# Altium schematic sheet DIG_INTERFACES.SchDoc
size A3; DocumentNumber: 3; Revision: B; SheetNumber: 3; SheetTotal: 7; SheetTitle: Connectors and Power; Designer: DM; Reviewer: -
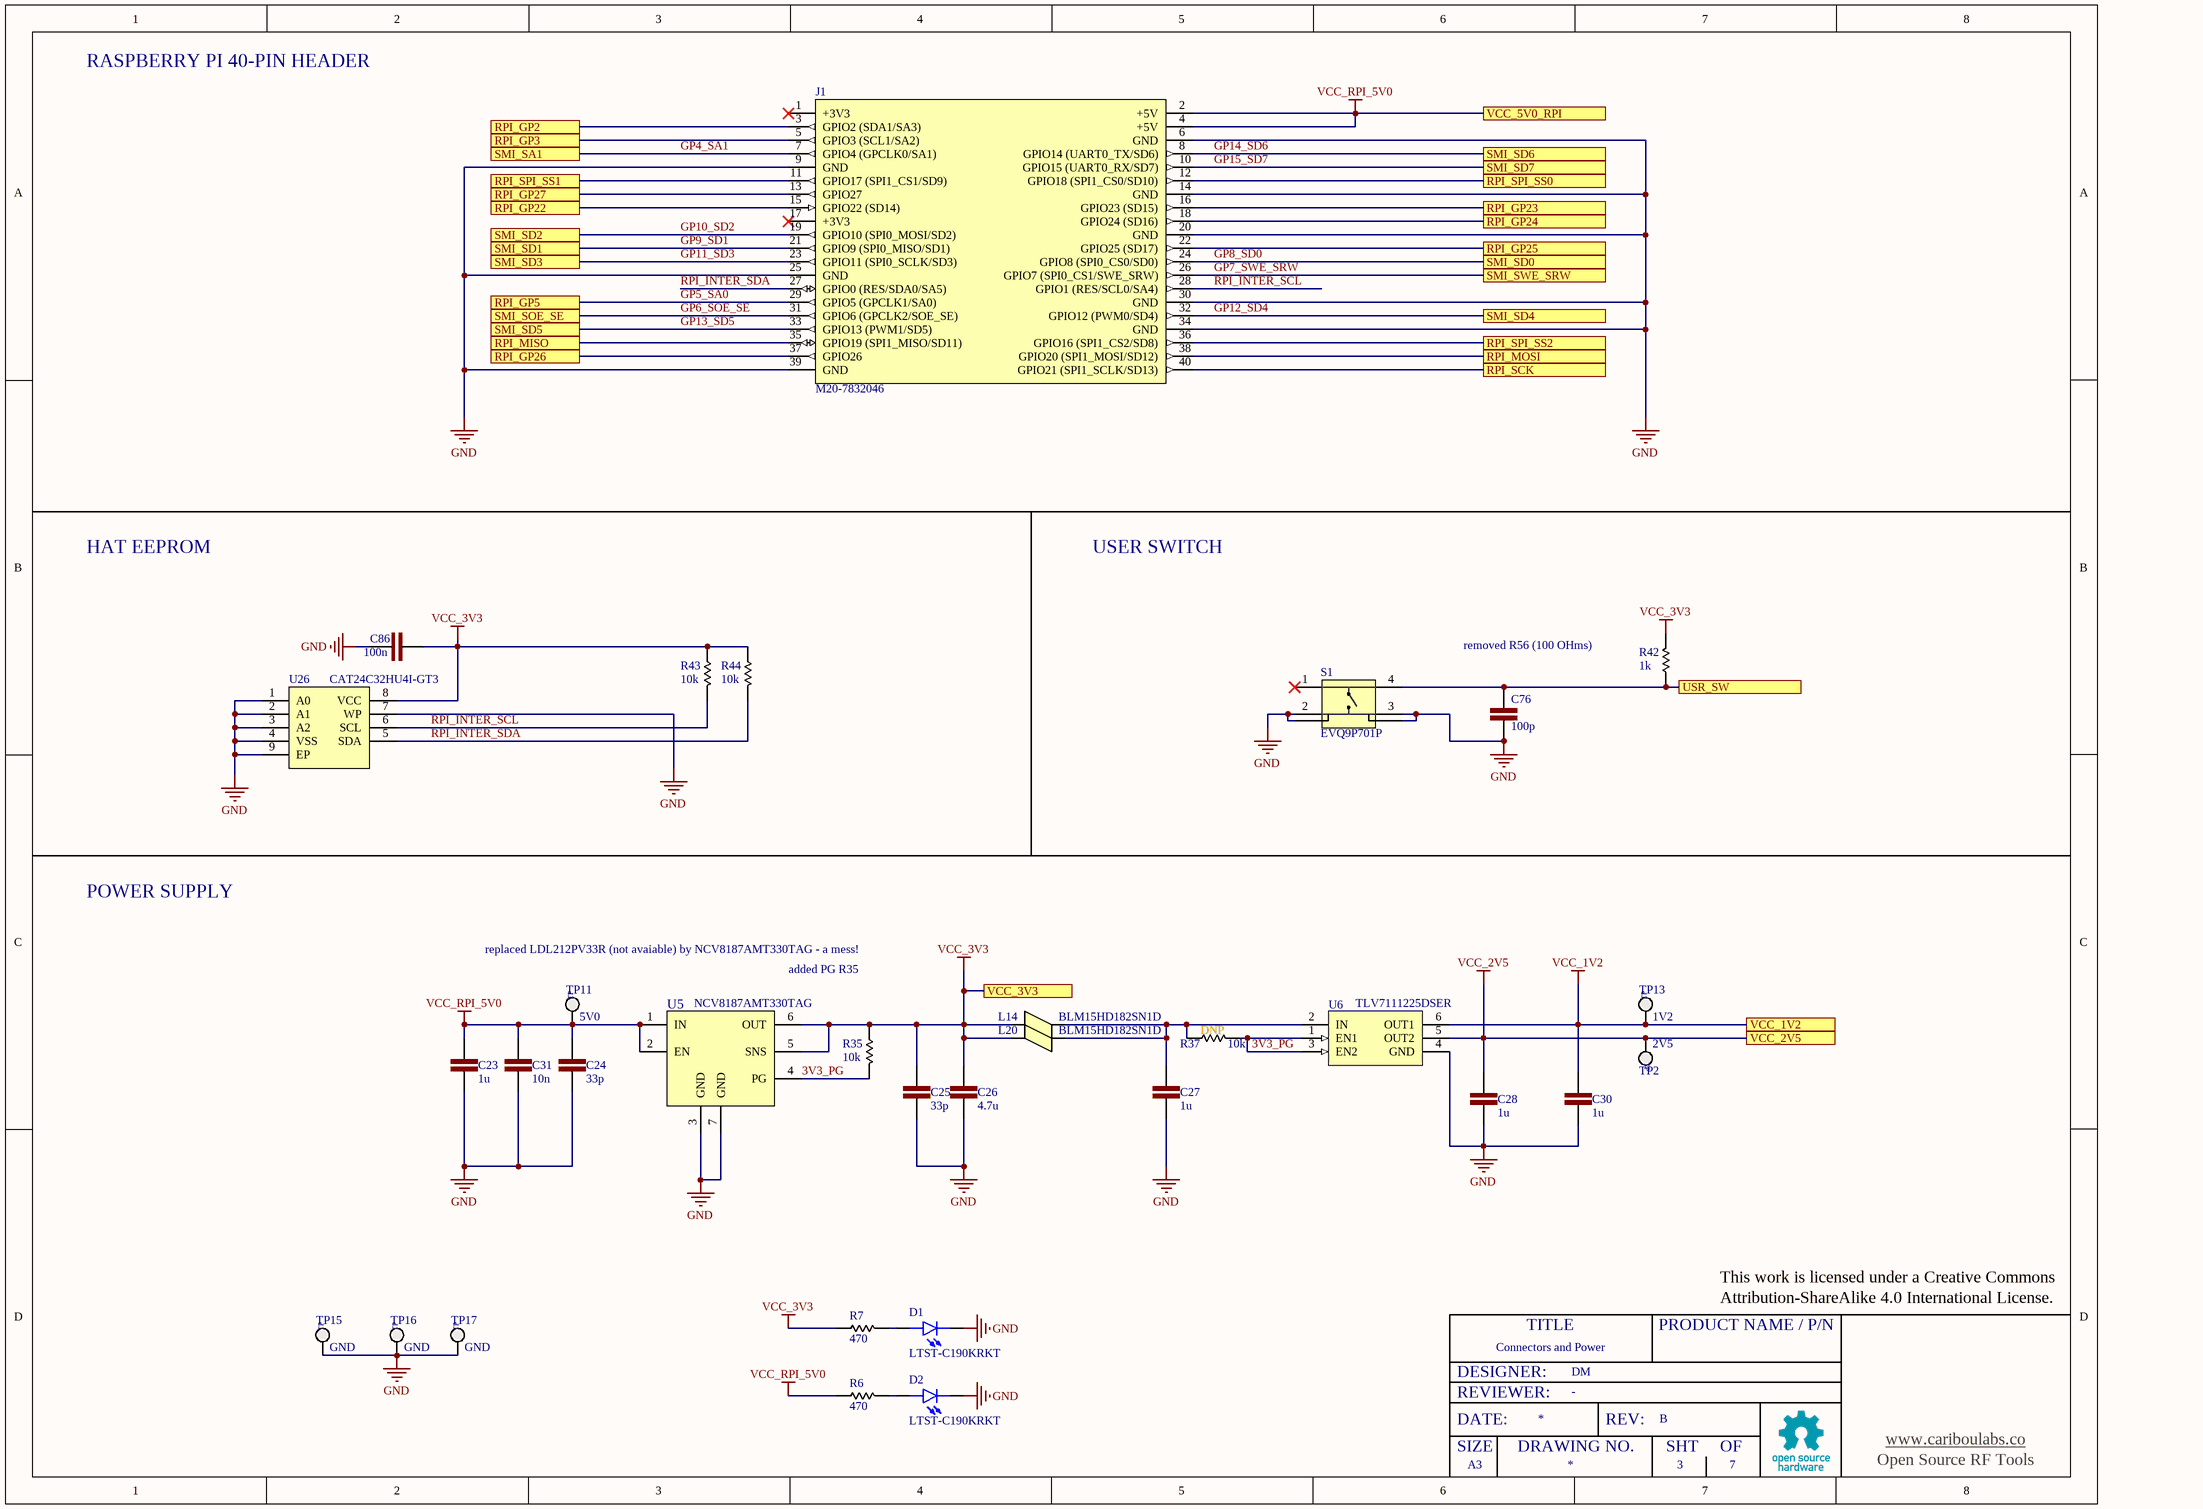
[diagram p0: DIG_INTERFACES.SchDoc]

## Parts
C23  1u  [MURATA 0402]
C24  33p  [MURATA 0402]
C25  33p  [MURATA 0402]
C26  4.7u  [MURATA 0402]
C27  1u  [MURATA 0402]
C28  1u  [MURATA 0402]
C30  1u  [MURATA 0402]
C31  10n  [MURATA 0402]
C76  100p  [MURATA 0402]
C86  100n  [MURATA 0402]
D1  LTST-C190KRKT  [LEDC1608X35N]
D2  LTST-C190KRKT  [LEDC1608X35N]
J1  M20-7832046  [rpi_zero]
L14  BLM15HD182SN1D  [0402 FERRITE BEAD]
L20  BLM15HD182SN1D  [0402 FERRITE BEAD]
R6  470  [PANASONIC 0402]
R7  470  [PANASONIC 0402]
R35  10k  [PANASONIC 0402]
R37  10k  [PANASONIC 0402]  (no BOM)
R42  1k  [PANASONIC 0402]
R43  10k  [PANASONIC 0402]
R44  10k  [PANASONIC 0402]
S1  EVQ9P701P  [EVQ9P701P]
TP2  2V5  [TP_40]
TP11  5V0  [TP_40]
TP13  1V2  [TP_40]
TP15  GND  [TP_40]
TP16  GND  [TP_40]
TP17  GND  [TP_40]
U5  NCV8187AMT330TAG  [SON65P200X200X80-7N]
U6  TLV7111225DSER  [SON50P150X150X80-6N]
U26  CAT24C32HU4I-GT3  [SON50P300X200X55-9N]

## Ports
RPI_GP2, RPI_GP3, RPI_GP5, RPI_GP22, RPI_GP23, RPI_GP24, RPI_GP25, RPI_GP26, RPI_GP27, RPI_MISO, RPI_MOSI, RPI_SCK, RPI_SPI_SS0, RPI_SPI_SS1, RPI_SPI_SS2, SMI_SA1, SMI_SD0, SMI_SD1, SMI_SD2, SMI_SD3, SMI_SD4, SMI_SD5, SMI_SD6, SMI_SD7, SMI_SOE_SE, SMI_SWE_SRW, USR_SW, VCC_1V2, VCC_2V5, VCC_3V3, VCC_5V0_RPI

## Nets
GND: C23.1 C24.2 C25.2 C26.1 C27.1 C28.1 C30.1 C31.2 C76.1 C86.1 D1.C D2.C J1.6(GND) J1.9(GND) J1.14(GND) J1.20(GND) J1.25(GND) J1.30(GND) J1.34(GND) J1.39(GND) S1.2 S1.3 S1.5 S1.6 TP15.1(TP) TP16.1(TP) TP17.1(TP) U5.3(GND) U5.7(GND) U6.4(GND) U26.1(A0) U26.2(A1) U26.3(A2) U26.4(VSS) U26.7(WP) U26.9(EP)
VCC_1V2: C30.2 TP13.1(TP) U6.6(OUT1) ; port VCC_1V2
VCC_2V5: C28.2 TP2.1(TP) U6.5(OUT2) ; port VCC_2V5
VCC_3V3: C25.1 C26.2 C86.2 L14.1 L20.1 R7.1 R35.1 R42.2 R43.1 R44.1 U5.5(SNS) U5.6(OUT) U26.8(VCC) ; port VCC_3V3
VCC_RPI_5V0: C23.2 C24.1 C31.1 J1.2(+5V) J1.4(+5V) R6.1 TP11.1(TP) U5.1(IN) U5.2(EN) ; port VCC_5V0_RPI
3V3_PG: R35.2 R37.2 U5.4(PG) U6.1(EN1) U6.3(EN2)
GP4_SA1: J1.7(GPIO4_(GPCLK0/SA1)) ; port SMI_SA1
GP5_SA0: J1.29(GPIO5_(GPCLK1/SA0)) ; port RPI_GP5
GP6_SOE_SE: J1.31(GPIO6_(GPCLK2/SOE_SE)) ; port SMI_SOE_SE
GP7_SWE_SRW: J1.26(GPIO7_(SPI0_CS1/SWE_SRW)) ; port SMI_SWE_SRW
GP8_SD0: J1.24(GPIO8_(SPI0_CS0/SD0)) ; port SMI_SD0
GP9_SD1: J1.21(GPIO9_(SPI0_MISO/SD1)) ; port SMI_SD1
GP10_SD2: J1.19(GPIO10_(SPI0_MOSI/SD2)) ; port SMI_SD2
GP11_SD3: J1.23(GPIO11_(SPI0_SCLK/SD3)) ; port SMI_SD3
GP12_SD4: J1.32(GPIO12_(PWM0/SD4)) ; port SMI_SD4
GP13_SD5: J1.33(GPIO13_(PWM1/SD5)) ; port SMI_SD5
GP14_SD6: J1.8(GPIO14_(UART0_TX/SD6)) ; port SMI_SD6
GP15_SD7: J1.10(GPIO15_(UART0_RX/SD7)) ; port SMI_SD7
RPI_GP2: J1.3(GPIO2_(SDA1/SA3)) ; port RPI_GP2
RPI_GP3: J1.5(GPIO3_(SCL1/SA2)) ; port RPI_GP3
RPI_GP22: J1.15(GPIO22_(SD14)) ; port RPI_GP22
RPI_GP23: J1.16(GPIO23_(SD15)) ; port RPI_GP23
RPI_GP24: J1.18(GPIO24_(SD16)) ; port RPI_GP24
RPI_GP25: J1.22(GPIO25_(SD17)) ; port RPI_GP25
RPI_GP26: J1.37(GPIO26) ; port RPI_GP26
RPI_GP27: J1.13(GPIO27) ; port RPI_GP27
RPI_INTER_SCL: J1.28(GPIO1_(RES/SCL0/SA4)) R43.2 U26.6(SCL)
RPI_INTER_SDA: J1.27(GPIO0_(RES/SDA0/SA5)) R44.2 U26.5(SDA)
RPI_MISO: J1.35(GPIO19_(SPI1_MISO/SD11)) ; port RPI_MISO
RPI_MOSI: J1.38(GPIO20_(SPI1_MOSI/SD12)) ; port RPI_MOSI
RPI_SCK: J1.40(GPIO21_(SPI1_SCLK/SD13)) ; port RPI_SCK
RPI_SPI_SS0: J1.12(GPIO18_(SPI1_CS0/SD10)) ; port RPI_SPI_SS0
RPI_SPI_SS1: J1.11(GPIO17_(SPI1_CS1/SD9)) ; port RPI_SPI_SS1
RPI_SPI_SS2: J1.36(GPIO16_(SPI1_CS2/SD8)) ; port RPI_SPI_SS2
USR_SW: C76.2 R42.1 S1.4 ; port USR_SW
NetC27_2: C27.2 L14.2 L20.2 R37.1 U6.2(IN)
NetD1_A: D1.A R7.2
NetD2_A: D2.A R6.2

Not connected (* = marked no-connect by the designer): J1 1(+3V3)* 17(+3V3)*; S1 1*

## Notes on the sheet
- RASPBERRY PI 40-PIN HEADER
- HAT EEPROM
- USER SWITCH
- removed R56 (100 OHms)
- POWER SUPPLY
- replaced LDL212PV33R (not avaiable) by NCV8187AMT330TAG - a mess!
- added PG R35
- (near R37) DNP
- This work is licensed under a Creative Commons
- Attribution-ShareAlike 4.0 International License.
- DESIGNER:
- REVIEWER:
- TITLE
- PRODUCT NAME / P/N
- SIZE
- DATE:
- DRAWING NO.
- REV:
- SHT
- OF
- www.cariboulabs.co
- A3
- Open Source RF Tools

## Library data of the parts
C23 C27 C28 C30 = Capacitor: Multilayer Ceramic Capacitors MLCC - SMD/SMT 0402 10VDC 1uF 20% X5R; Tolerance: 5%; Vmax: 10V; Manu. P/N: LMK105BJ105MVHF; Temp. Range: [-55, 85]; SRF: TBD [GHz]; Initial Voltage: 0; Technology: X5R; VALUE: 1u
C24 C25 = Capacitor: Multilayer Ceramic Capacitors MLCC - SMD/SMT 0402 50V 33pF C0G 0402 5%; Manu. P/N: C0402C330J5GAC; Temp. Range: [-55, 125]; SRF: TBD [GHz]; Initial Voltage: 0; Tolerance: 5%; Vmax: 50V; Technology: C0G; VALUE: 33p
C26 = Capacitor: Multilayer Ceramic Capacitors MLCC - SMD/SMT 0402 MLCC X5R 4.7 uF +/ -20% 10V; Tolerance: 20%; Manu. P/N: GRJ155R61A475ME11J; Temp. Range: [-55, 85]; SRF: TBD [GHz]; Initial Voltage: 0; Vmax: 10V; Technology: X5R; VALUE: 4.7u
C31 = Capacitor: Multilayer Ceramic Capacitors MLCC - SMD/SMT 0402, 0.01UF 25V C0G; Tolerance: 5%; Manu. P/N: GRM1555C1E103JE01J; Temp. Range: [-55, 125]; SRF: TBD [GHz]; Initial Voltage: 0; Vmax: 25V; Technology: C0G; VALUE: 10n
C76 = Capacitor: Multilayer Ceramic Capacitors MLCC - SMD/SMT 50V 100pF +/-0.05; Tolerance: 0.05pF; Manu. P/N: C0402C101J5GACTU; Temp. Range: [-55, 125]; SRF: TBD [GHz]; Initial Voltage: 0; Vmax: 50V; Technology: C0G; VALUE: 100p
C86 = Capacitor: Multilayer Ceramic Capacitors MLCC - SMD/SMT 16V .1uF X5R 0402 10%; Manu. P/N: 0402YD104KAT2A; Temp. Range: [-55, 85]; SRF: TBD [GHz]; Initial Voltage: 0; Tolerance: 10%; Vmax: 16V; Technology: X5R; VALUE: 100n
D1 D2 = LTST-C190KRKT: Red 631nm LED Indication - Discrete 2V 0603; Manu. P/N: LTST-C190KRKT
J1 = RaspberryPi: RPI 40-pin 2.54mm header, 2-rows, socket; Manu. P/N: M20-7832046, PPPC202LFBN-RC, 61304021821
L14 L20 = BLM15: Ferrite Beads 1800ohms GHz HiSpd; Imax: 0.2 A; Max DC Resistance: 2.2 Ohms; Temp. Range: [-40, 125]; Tolerance: 25%; Impedance @ 100 MHz: 1800 Ohms; Manu. P/N: BLM15HD182SN1D
R6 R7 = Resistor: Thick Film Resistors - SMD 1/16watt 470ohms 1%; Manu. P/N: CRCW0402470RFKED; Power Rating: 62.5 mW (1/16 W); Temp. Ceoff.: 100 PPM / C; Tolerance: 1%; VALUE: 470
R35 R37 R43 R44 = Resistor: Thick Film Resistors - SMD 0402 1/16watt 10Kohms 1%; Manu. P/N: CRCW040210K0FKEDC; Power Rating: 62.5 mW (1/16 W); Temp. Ceoff.: 100 PPM/C; Tolerance: 1%; VALUE: 10k
R42 = Resistor: Thick Film Resistors - SMD 0402 1/16watt 1Kohms 1%; Manu. P/N: CRCW04021K00FKEDC; Power Rating: 62.5 mW (1/16 W); Temp. Ceoff.: 100 PPM/C; Tolerance: 1%; VALUE: 1k
S1 = EVQ9P701P: Tactile Switches SMD 3.5X2.9MM SID-OP L SHAPED TERM 1.6N; Manu. P/N: EVQ9P701P
TP2 TP11 TP13 TP15-TP17 = TEST_POINT
U5 = NCV8187AMT330TAG: LDO Voltage Regulators 1.2A 3.3V Active discharge; Manu. P/N: NCV8187AMT330TAG
U6 = TLV7111225DSER: LDO Voltage Regulators Dual 200mA Output Lo Noise Hi PSRR LDO Rg; Manu. P/N: TLV7111225DSER
U26 = CAT24C32HU4I-GT3: EEPROM Serial-I2C 32K 4Kx8 1.8V/5V UDFN8 CAT24C32HU4I-GT3; Manu. P/N: CAT24C32HU4I-GT3